# Altium schematic sheet SigCapture3.SchDoc
size A
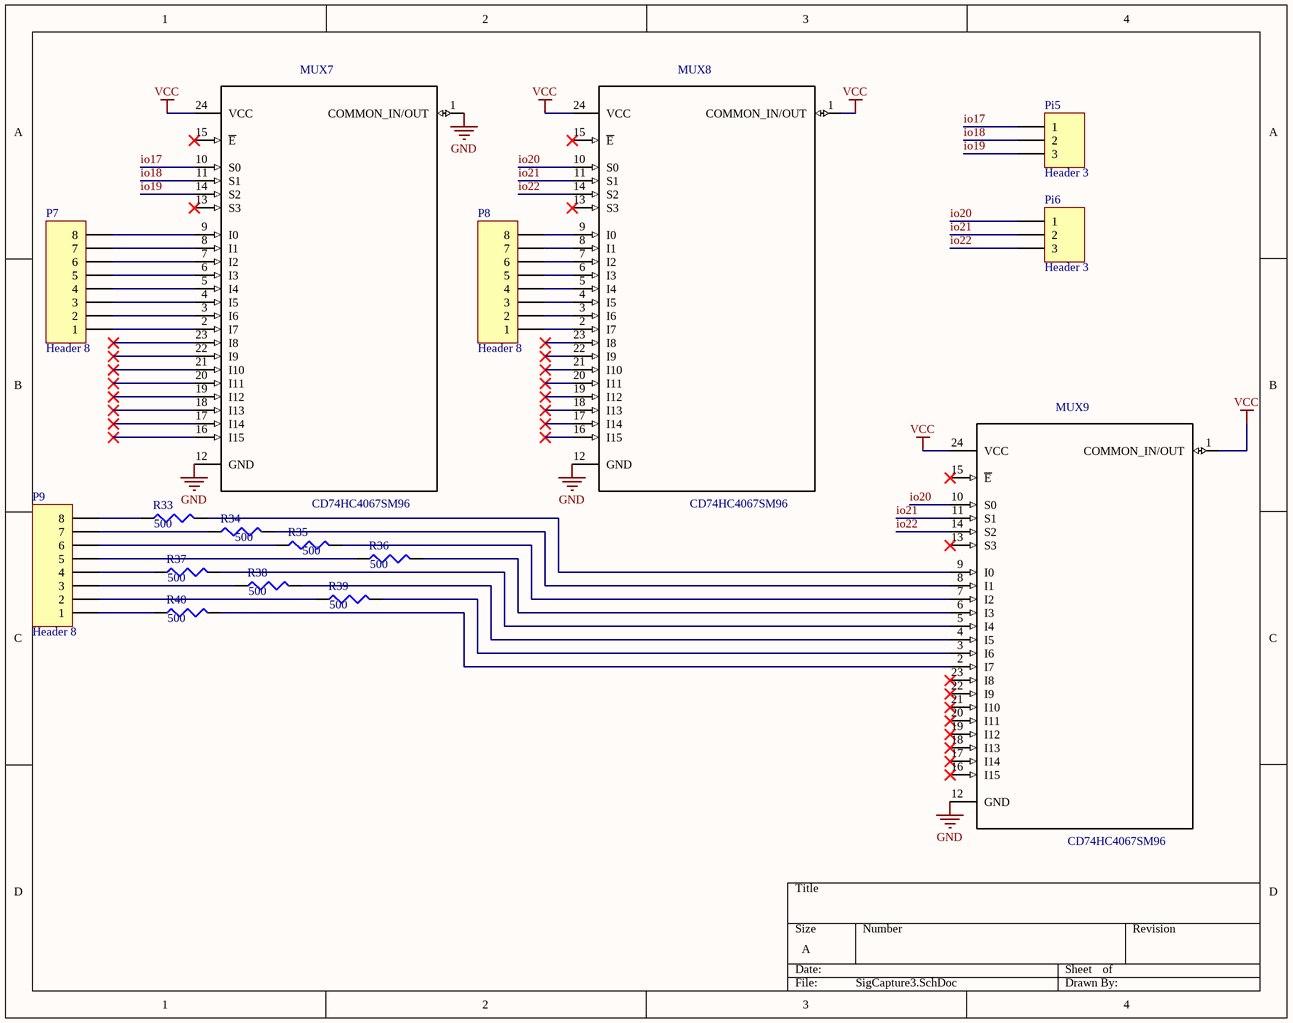
[diagram p0: SigCapture3.SchDoc]

## Parts
MUX7  CD74HC4067SM96  [SOP65P780X200-24N]
MUX8  CD74HC4067SM96  [SOP65P780X200-24N]
MUX9  CD74HC4067SM96  [SOP65P780X200-24N]
P7  Header 8  [HDR1X8]
P8  Header 8  [HDR1X8]
P9  Header 8  [HDR1X8]
Pi5  Header 3  [HDR1X3]
Pi6  Header 3  [HDR1X3]
R33  value 500  [J1-0603]  (hidden comment: Res3)
R34  value 500  [J1-0603]  (hidden comment: Res3)
R35  value 500  [J1-0603]  (hidden comment: Res3)
R36  value 500  [J1-0603]  (hidden comment: Res3)
R37  value 500  [J1-0603]  (hidden comment: Res3)
R38  value 500  [J1-0603]  (hidden comment: Res3)
R39  value 500  [J1-0603]  (hidden comment: Res3)
R40  value 500  [J1-0603]  (hidden comment: Res3)

## Nets
GND: MUX7.1(COMMON_IN/OUT) MUX7.12(GND) MUX8.12(GND) MUX9.12(GND)
VCC: MUX7.24(VCC) MUX8.1(COMMON_IN/OUT) MUX8.24(VCC) MUX9.1(COMMON_IN/OUT) MUX9.24(VCC)
io17: MUX7.10(S0) Pi5.1
io18: MUX7.11(S1) Pi5.2
io19: MUX7.14(S2) Pi5.3
io20: MUX8.10(S0) MUX9.10(S0) Pi6.1
io21: MUX8.11(S1) MUX9.11(S1) Pi6.2
io22: MUX8.14(S2) MUX9.14(S2) Pi6.3
NetMUX7_2: MUX7.2(I7) P7.1
NetMUX7_3: MUX7.3(I6) P7.2
NetMUX7_4: MUX7.4(I5) P7.3
NetMUX7_5: MUX7.5(I4) P7.4
NetMUX7_6: MUX7.6(I3) P7.5
NetMUX7_7: MUX7.7(I2) P7.6
NetMUX7_8: MUX7.8(I1) P7.7
NetMUX7_9: MUX7.9(I0) P7.8
NetMUX8_2: MUX8.2(I7) P8.1
NetMUX8_3: MUX8.3(I6) P8.2
NetMUX8_4: MUX8.4(I5) P8.3
NetMUX8_5: MUX8.5(I4) P8.4
NetMUX8_6: MUX8.6(I3) P8.5
NetMUX8_7: MUX8.7(I2) P8.6
NetMUX8_8: MUX8.8(I1) P8.7
NetMUX8_9: MUX8.9(I0) P8.8
NetMUX9_2: MUX9.2(I7) R40.2
NetMUX9_3: MUX9.3(I6) R39.2
NetMUX9_4: MUX9.4(I5) R38.2
NetMUX9_5: MUX9.5(I4) R37.2
NetMUX9_6: MUX9.6(I3) R36.2
NetMUX9_7: MUX9.7(I2) R35.2
NetMUX9_8: MUX9.8(I1) R34.2
NetMUX9_9: MUX9.9(I0) R33.2
NetP9_1: P9.1 R40.1
NetP9_2: P9.2 R39.1
NetP9_3: P9.3 R38.1
NetP9_4: P9.4 R37.1
NetP9_5: P9.5 R36.1
NetP9_6: P9.6 R35.1
NetP9_7: P9.7 R34.1
NetP9_8: P9.8 R33.1

Not connected (* = marked no-connect by the designer): MUX7 13(S3)* 15(~{E})* 16(I15)* 17(I14)* 18(I13)* 19(I12)* 20(I11)* 21(I10)* 22(I9)* 23(I8)*; MUX8 13(S3)* 15(~{E})* 16(I15)* 17(I14)* 18(I13)* 19(I12)* 20(I11)* 21(I10)* 22(I9)* 23(I8)*; MUX9 13(S3)* 15(~{E})* 16(I15)* 17(I14)* 18(I13)* 19(I12)* 20(I11)* 21(I10)* 22(I9)* 23(I8)*

## Library data of the parts
MUX7-MUX9 = CD74HC4067SM96: High Speed CMOS 16-Channel Analog Multiplexer/Demultiplexer 24-SSOP -55 to 125; MF: Texas Instruments; MP: CD74HC4067SM96; Price: None; Availability: Unavailable; Package: SSOP-24 Texas Instruments; SnapEDA_Link: https://www.snapeda.com/parts/CD74HC4067SM96/Texas%20Instruments/view-part/?ref=snap; Value: *
P7-P9 = Header 8: Header, 8-Pin; LatestRevisionDate: 17-Jul-2002; LatestRevisionNote: Re-released for DXP Platform.; Publisher: Altium Limited
Pi5 Pi6 = Header 3: Header, 3-Pin; LatestRevisionDate: 17-Jul-2002; LatestRevisionNote: Re-released for DXP Platform.; Publisher: Altium Limited
R33-R40 = Res3: Resistor; Published: 8-Jun-2000; LatestRevisionDate: 29-May-2009; LatestRevisionNote: IPC-7351 Footprint Added.; PackageReference: J1-0603; Publisher: Altium Limited; PackageDescription: Chip Resistor